# EAGLE design board_0.3v(fab) (EAGLE 7.7.0)
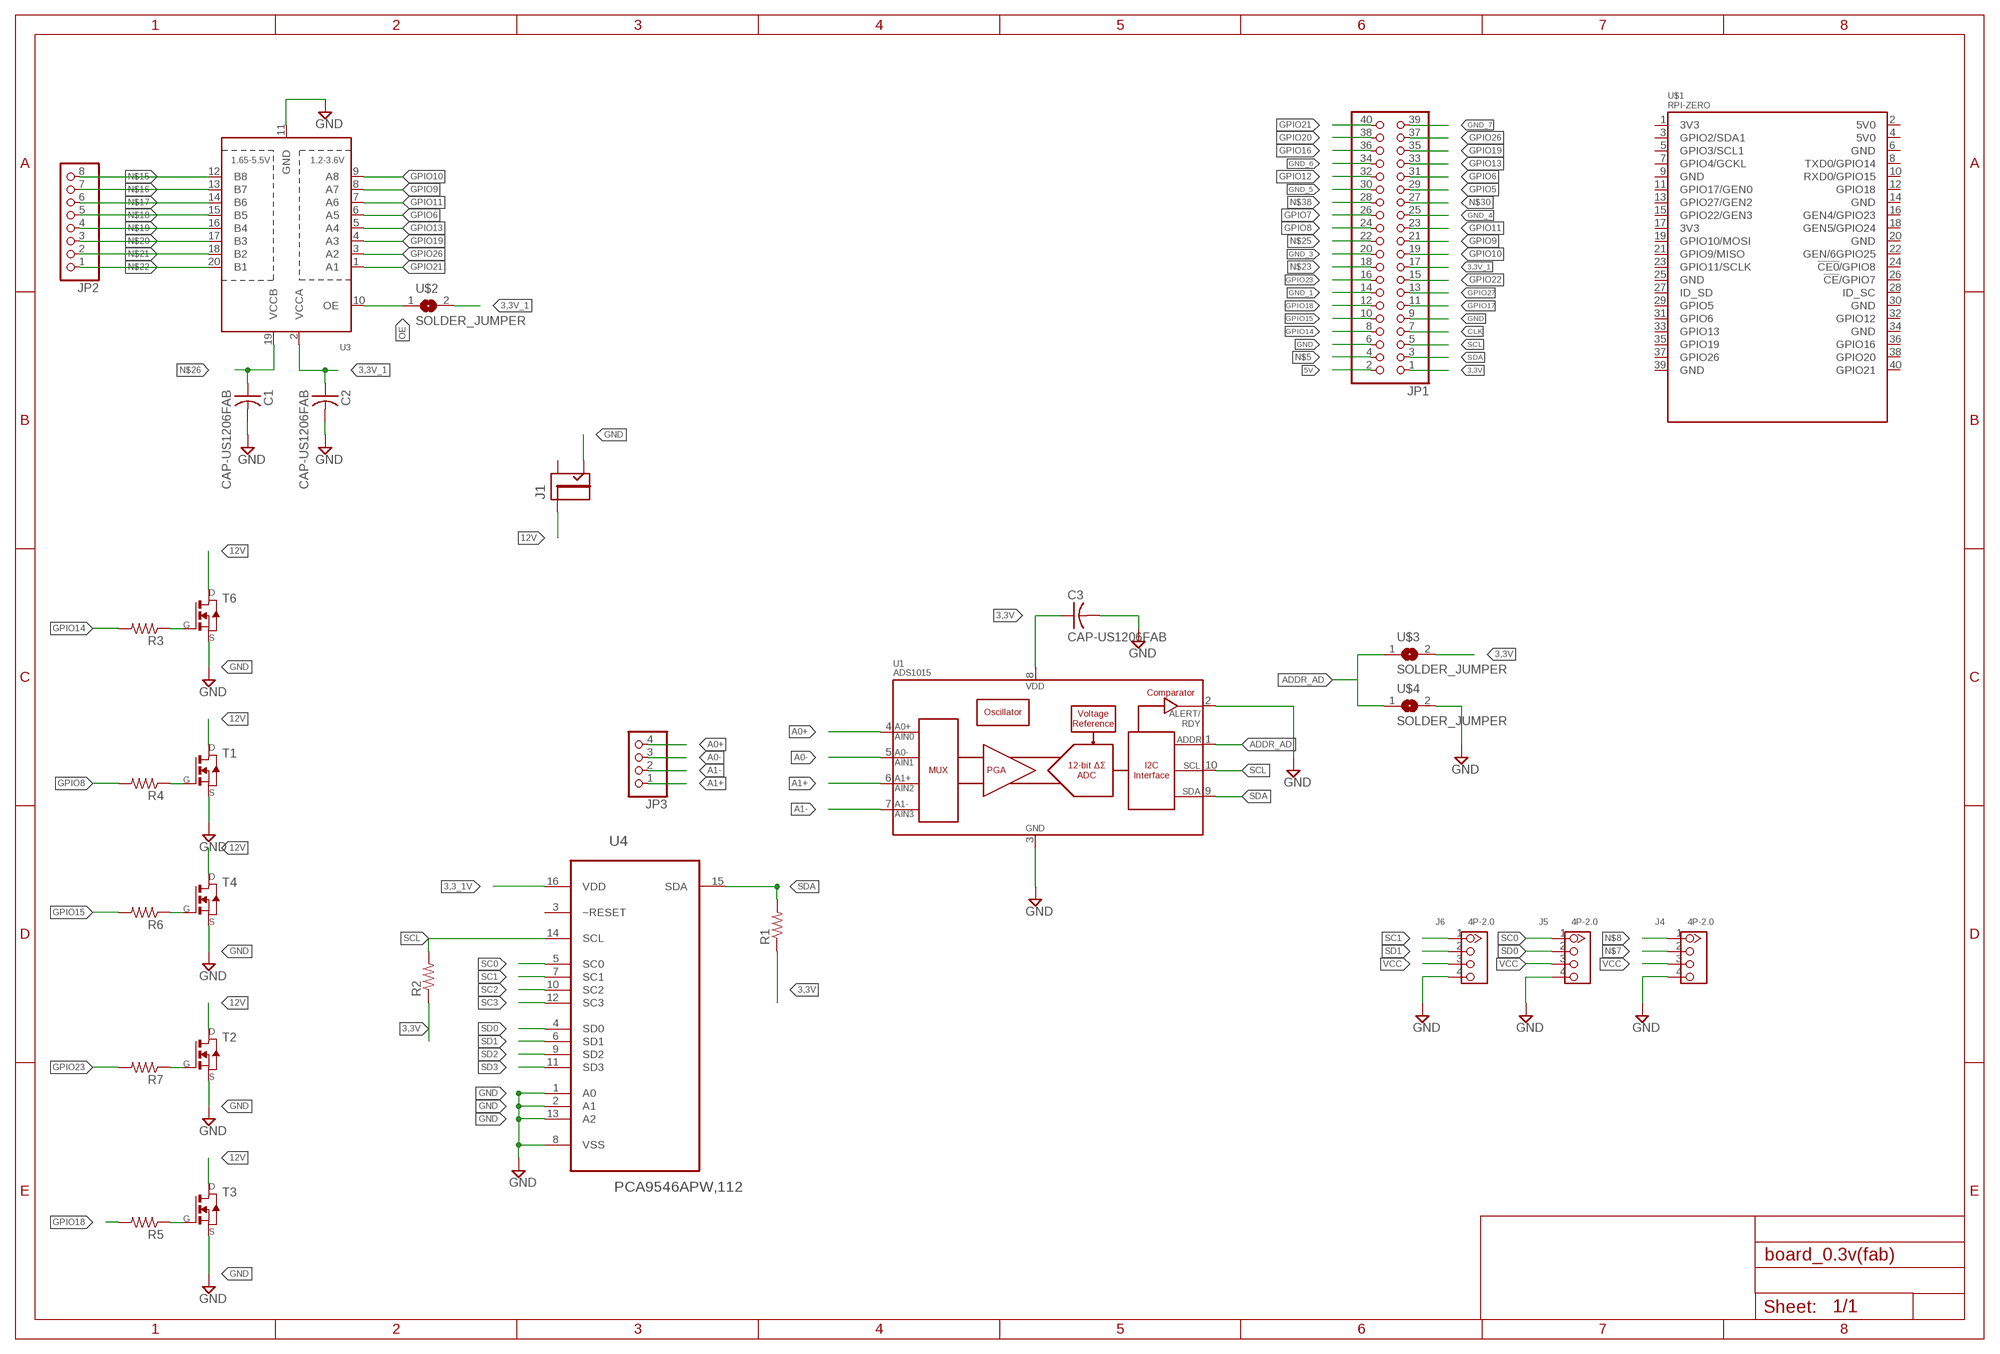
[diagram p0: schematic, sheet 1]

## Parts
C1  CAP-US1206FAB  [C1206FAB]
C2  CAP-US1206FAB  [C1206FAB]
C3  CAP-US1206FAB  [C1206FAB]
J1  JACK2.1MM  [JACK_2.1MM]
J4  4P-2.0  GROVE-CONNECTOR-DIP(4P-2.0)  [HW4-2.0]
J5  4P-2.0  GROVE-CONNECTOR-DIP(4P-2.0)  [HW4-2.0]
J6  4P-2.0  GROVE-CONNECTOR-DIP(4P-2.0)  [HW4-2.0]
JP1  PINHD-2X20  [2X20]
JP2  PINHD-1X8BIG  [1X08-BIG]
JP3  PINHD-1X4  [1X04]
R1  RES-US1206FAB  [R1206FAB]
R2  RES-US1206FAB  [R1206FAB]
R3  RES-US1206FAB  [R1206FAB]
R4  RES-US1206FAB  [R1206FAB]
R5  RES-US1206FAB  [R1206FAB]
R6  RES-US1206FAB  [R1206FAB]
R7  RES-US1206FAB  [R1206FAB]
T1  NMOSFETTO252  [TO252]
T2  NMOSFETTO252  [TO252]
T3  NMOSFETTO252  [TO252]
T4  NMOSFETTO252  [TO252]
T6  NMOSFETTO252  [TO252]
U1  ADS1015  [MSOP10]
U3  TXB0108PWR  [TSSOP20]
U4  PCA9546APW,112  [SOP65P640X110-16N]
U$1  RPI-ZERO  [RASPBERRYPI_BASTELSTUBE_V13_RASPI_BOARD_B+_FULL]
U$2  SOLDER_JUMPER  [SJFAB]
U$3  SOLDER_JUMPER  [SJFAB]
U$4  SOLDER_JUMPER  [SJFAB]

## Nets
3,3_1V: U4.16(VDD)
3,3V: C3.1 JP1.1 R1.1 R2.1 U1.8(VDD) U$3.2
3,3V_1: C2.1 JP1.17 U3.2(VCCA) U$2.2
5V: JP1.2
12V: J1.PIN T1.3(D) T2.3(D) T3.3(D) T4.3(D) T6.3(D)
A0+: JP3.4 U1.4(AIN0)
A0-: JP3.3 U1.5(AIN1)
A1+: JP3.1 U1.6(AIN2)
A1-: JP3.2 U1.7(AIN3)
ADDR_AD: U1.1(ADDR) U$3.1 U$4.1
CLK: JP1.7
GND: C1.2 C2.2 C3.2 J1.CONTACT J4.4 J5.4 J6.4 JP1.6 JP1.9 T1.2(S) T2.2(S) T3.2(S) T4.2(S) T6.2(S) U1.2(ALERT/RDY) U1.3(VSS) U3.11(GND) U4.1(A0) U4.2(A1) U4.8(VSS) U4.13(A2) U$4.2
GND_1: JP1.14
GND_3: JP1.20
GND_4: JP1.25
GND_5: JP1.30
GND_6: JP1.34
GND_7: JP1.39
GPIO5: JP1.29
GPIO6: JP1.31 U3.6(A5)
GPIO7: JP1.26
GPIO8: JP1.24 R4.2
GPIO9: JP1.21 U3.8(A7)
GPIO10: JP1.19 U3.9(A8)
GPIO11: JP1.23 U3.7(A6)
GPIO12: JP1.32
GPIO13: JP1.33 U3.5(A4)
GPIO14: JP1.8 R3.2
GPIO15: JP1.10 R6.2
GPIO16: JP1.36
GPIO17: JP1.11
GPIO18: JP1.12 R5.2
GPIO19: JP1.35 U3.4(A3)
GPIO20: JP1.38
GPIO21: JP1.40 U3.1(A1)
GPIO22: JP1.15
GPIO23: JP1.16 R7.2
GPIO26: JP1.37 U3.3(A2)
GPIO27: JP1.13
N$5: JP1.4
N$6: R3.1 T6.1(G)
N$7: J4.2
N$8: J4.1
N$9: R4.1 T1.1(G)
N$10: R6.1 T4.1(G)
N$11: R7.1 T2.1(G)
N$12: R5.1 T3.1(G)
N$15: JP2.8 U3.12(B8)
N$16: JP2.7 U3.13(B7)
N$17: JP2.6 U3.14(B6)
N$18: JP2.5 U3.15(B5)
N$19: JP2.4 U3.16(B4)
N$20: JP2.3 U3.17(B3)
N$21: JP2.2 U3.18(B2)
N$22: JP2.1 U3.20(B1)
N$23: JP1.18
N$25: JP1.22
N$26: C1.1 U3.19(VCCB)
N$30: JP1.27
N$38: JP1.28
OE: U3.10(OE) U$2.1
SC0: J5.1 U4.5(SC0)
SC1: J6.1 U4.7(SC1)
SC2: U4.10(SC2)
SC3: U4.12(SC3)
SCL: JP1.5 R2.2 U1.10(SCL) U4.14(SCL)
SD0: J5.2 U4.4(SD0)
SD1: J6.2 U4.6(SD1)
SD2: U4.9(SD2)
SD3: U4.11(SD3)
SDA: JP1.3 R1.2 U1.9(SDA) U4.15(SDA)
VCC: J4.3 J5.3 J6.3
Unconnected: J1.SHUNT U4.3(~RESET) U$1.1(3V3) U$1.2(5V0) U$1.3(GPIO2/SDA1) U$1.4(5V0) U$1.5(GPIO3/SCL1) U$1.6(GND) U$1.7(GPIO4/GCKL) U$1.8(TXD0/GPIO14) U$1.9(GND) U$1.10(RXD0/GPIO15) U$1.11(GPIO17/GEN0) U$1.12(GPIO18) U$1.13(GPIO27/GEN2) U$1.14(GND) U$1.15(GPIO22/GEN3) U$1.16(GEN4/GPIO23) U$1.17(3V3) U$1.18(GEN5/GPIO24) U$1.19(GPIO10/MOSI) U$1.20(GND) U$1.21(GPIO9/MISO) U$1.22(GEN/6GPIO25) U$1.23(GPIO11/SCLK) U$1.24(!CE0!/GPIO8) U$1.25(GND) U$1.26(!CE!/GPIO7) U$1.27(ID_SD) U$1.28(ID_SC) U$1.29(GPIO5) U$1.30(GND) U$1.31(GPIO6) U$1.32(GPIO12) U$1.33(GPIO13) U$1.34(GND) U$1.35(GPIO19) U$1.36(GPIO16) U$1.37(GPIO26) U$1.38(GPIO20) U$1.39(GND) U$1.40(GPIO21)

## Library data of the parts
C1-C3 = fab:CAP-US
J1 = fab:JACK
J4-J6 = Seeed-OPL-Connector:GROVE-CONNECTOR-DIP(4P-2.0): 320110033
JP1 = adafruit:PINHD-2X20: PIN HEADER
JP2 = adafruit:PINHD-1X8: PIN HEADER
JP3 = pinhead:PINHD-1X4: PIN HEADER
R1-R7 = fab:RES-US: Resistor (US Symbol) Variants with postfix FAB are widened to allow the routing of internal traces
T1-T4 T6 = fab_2:NMOSFET: MOS FET
U1 = SparkFun-IC-Conversion:ADS1015: ADS1015 12-BIT ADC 12-Bit Del-Sig ADC Four single-ended inputs or two differential inputs Internal PGA I2C interface 2.0-5.5V SparkFun Products SparkFun Block for Intel Edison - ADC <https://www.sparkfun.com/products/13770> (DEV-13770); PROD_ID: IC-12270
U3 = adafruit:TXB0108PWR: 8-Bit Bi-Directional Level Shifter 1.2V-3.6V (VCCA) to 1.65V-5.5V (VCCB) bi-directional level shifter with auto direction sensing. Max data rate - VCCA 1.8V: 20Mbps (50ns), VCCA 3.3V: 100Mbps (10ns) Digikey: 296-21527-1-ND
U4 = NXP_By_element14_Batch_1:PCA9546APW,112: 4-channel I2C-bus switch with reset; MPN: PCA9546APW,112; OC_FARNELL: 1831208; OC_NEWARK: 70R6610; PACKAGE: TSSOP-16; SUPPLIER: NXP
U$1 = RPI-Zero:RPI-ZERO
U$2-U$4 = fab:SOLDER_JUMPER

## Board
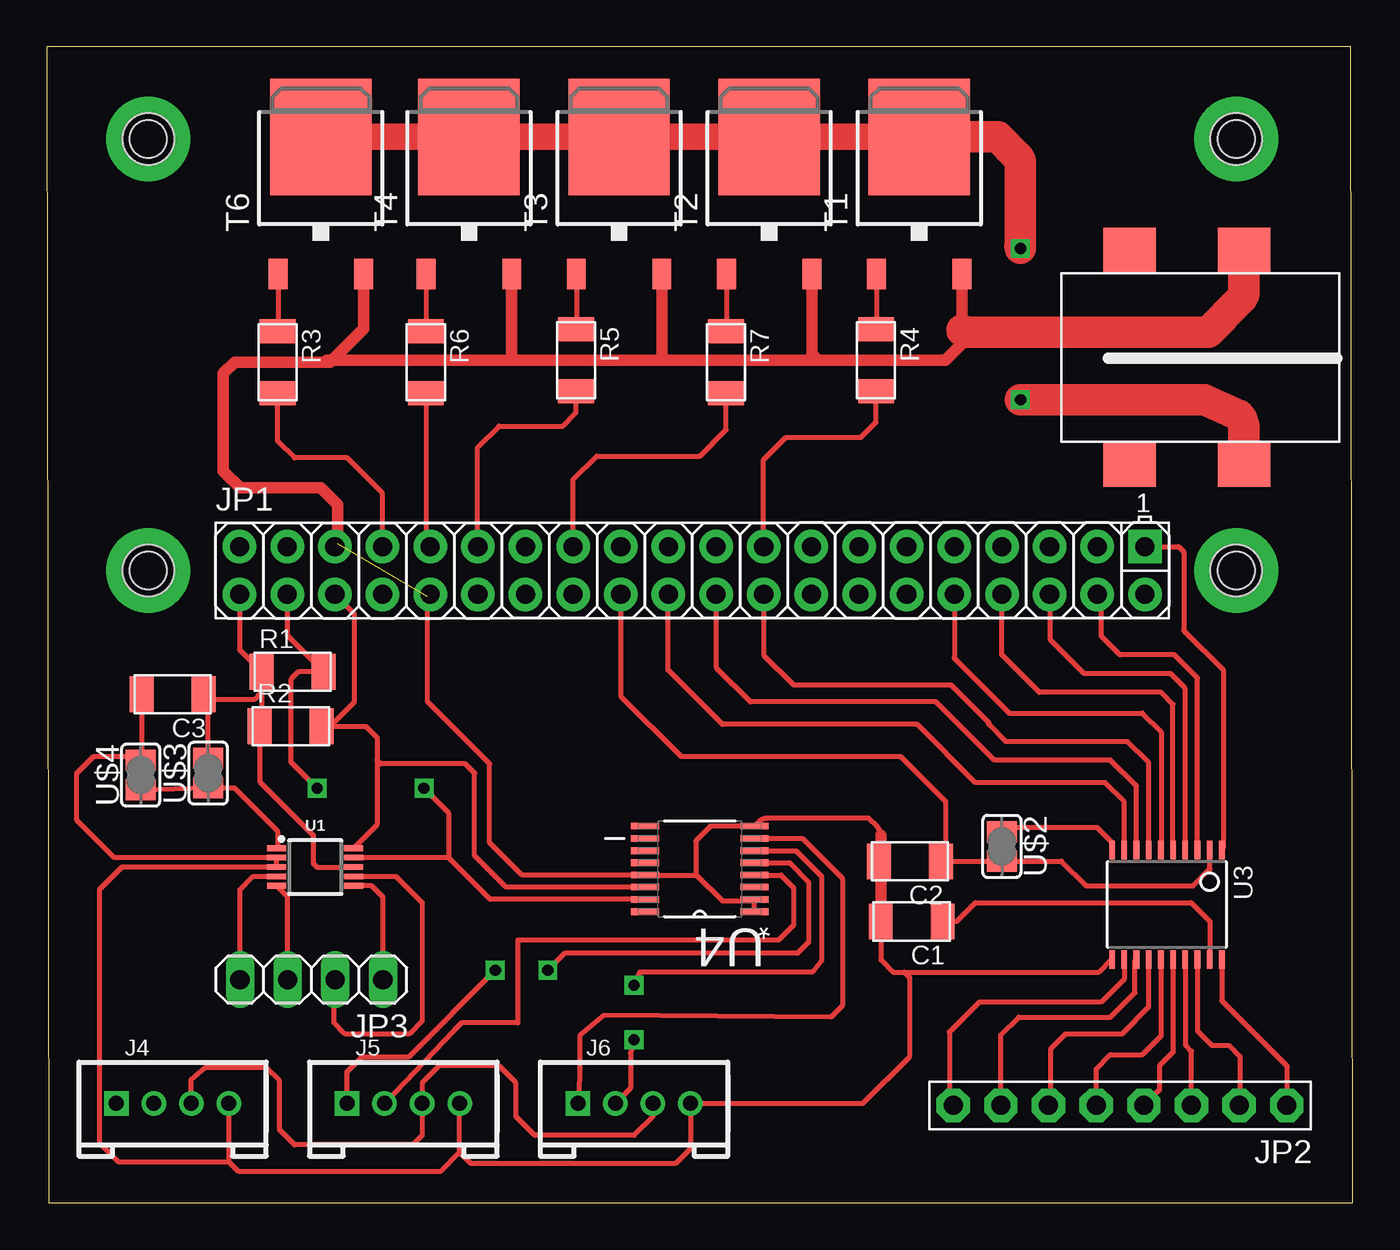
[diagram p1: board, top side]
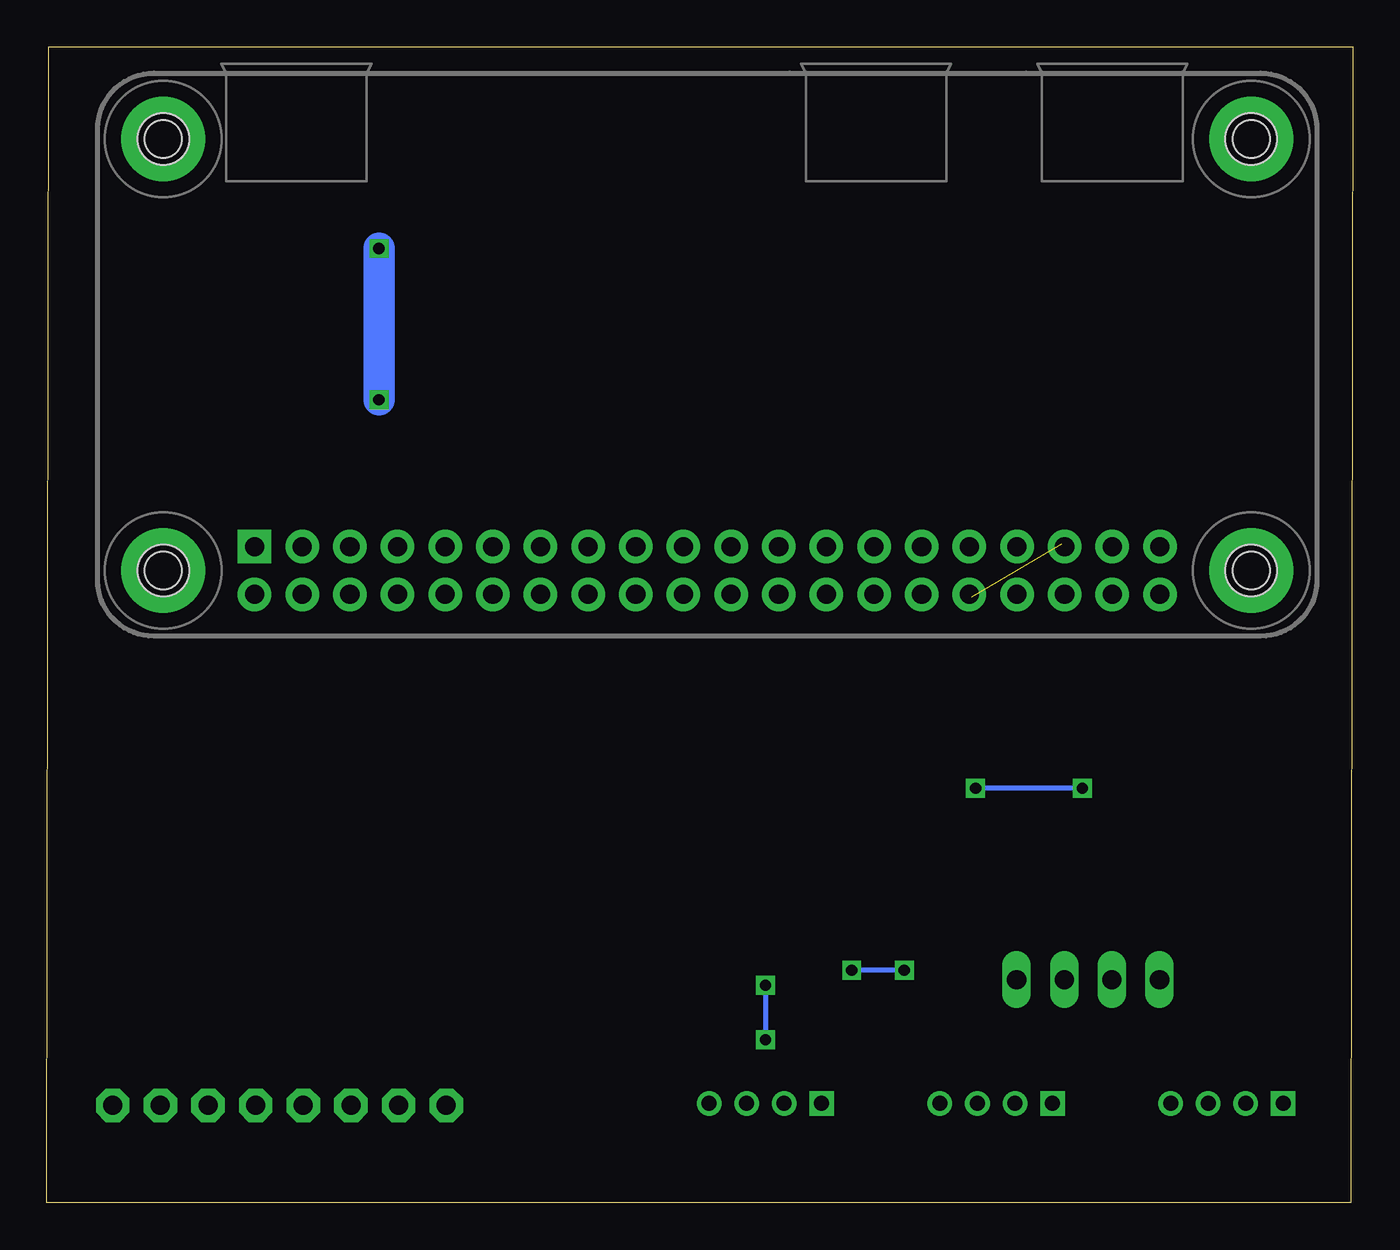
[diagram p2: board, bottom side, seen from below]

Size 69.6 x 61.6 mm. Coordinates in mm from the lower left corner, seen from the top.
Outline: 0.1,0 69.6,0 69.5,61.6 0,61.6 0.1,0
Copper layers (1*16): Top 0.035mm / dielectric 1.5mm / Bottom 0.035mm
Design rules "default": minimum track width 10mil, minimum drill 24mil, track to track 8mil, track to pad 8mil, pad to pad 8mil, via to via 8mil, smd to smd 8mil, copper to edge 40mil, drill to drill 8mil, minimum pad ring 10mil, minimum via ring 8mil, stop-mask expansion 4mil, vias tented up to drill 0mil, thermal gap 10mil
Holes 2 mm at 5.4,56.7 5.4,33.7 63.4,56.7 63.4,33.7

### Footprints (pad centres in the part's own frame; a part is rotated, then mirrored left to right if it is on the bottom)
C1206FAB = smd 1.27 x 1.905: 1 -1.651,0; 2 1.651,0
JACK_2.1MM = smd 2.388 x 2.794: CONTACT 5.766,-2.413; PIN -5.639,-2.413; PIN1 -5.639,3.683; SHUNT 5.766,3.683
HW4-2.0 = drill 0.8 pad 1.27 square: 1 -3,0 | drill 0.8 pad 1.27: 2 -1,0; 3 1,0; 4 3,0
2X20 = drill 1.016 octagon: 1 -24.13,-1.27; 2 -24.13,1.27; 3 -21.59,-1.27; 4 -21.59,1.27; 5 -19.05,-1.27; 6 -19.05,1.27; 7 -16.51,-1.27; 8 -16.51,1.27; 9 -13.97,-1.27; 10 -13.97,1.27; 11 -11.43,-1.27; 12 -11.43,1.27; 13 -8.89,-1.27; 14 -8.89,1.27; 15 -6.35,-1.27; 16 -6.35,1.27; 17 -3.81,-1.27; 18 -3.81,1.27; 19 -1.27,-1.27; 20 -1.27,1.27; 21 1.27,-1.27; 22 1.27,1.27; 23 3.81,-1.27; 24 3.81,1.27; 25 6.35,-1.27; 26 6.35,1.27; 27 8.89,-1.27; 28 8.89,1.27; 29 11.43,-1.27; 30 11.43,1.27; 31 13.97,-1.27; 32 13.97,1.27; 33 16.51,-1.27; 34 16.51,1.27; 35 19.05,-1.27; 36 19.05,1.27; 37 21.59,-1.27; 38 21.59,1.27; 39 24.13,-1.27; 40 24.13,1.27
1X08-BIG = drill 1.016 pad 1.778 octagon: 1 -8.89,0; 2 -6.35,0; 3 -3.81,0; 4 -1.27,0; 5 1.27,0; 6 3.81,0; 7 6.35,0; 8 8.89,0
1X04 = drill 1.016 long: 1 -3.81,0; 2 -1.27,0; 3 1.27,0; 4 3.81,0
R1206FAB = smd 1.27 x 1.905: 1 -1.651,0; 2 1.651,0
TO252 = smd 1 x 1.6: 1 -2.28,-4.8; 2 2.28,-4.8 | smd 5.4 x 6.2: 3 0,2.5
MSOP10 = smd 0.3 x 1: 1 -1,-2.05; 2 -0.5,-2.05; 3 0,-2.05; 4 0.5,-2.05; 5 1,-2.05; 6 1,2.05; 7 0.5,2.05; 8 0,2.05; 9 -0.5,2.05; 10 -1,2.05
TSSOP20 = smd 0.305 x 0.991: 1 -2.925,-2.918; 2 -2.275,-2.918; 3 -1.625,-2.918; 4 -0.975,-2.918; 5 -0.325,-2.918; 6 0.325,-2.918; 7 0.975,-2.918; 8 1.625,-2.918; 9 2.275,-2.918; 10 2.925,-2.918; 11 2.925,2.918; 12 2.275,2.918; 13 1.625,2.918; 14 0.975,2.918; 15 0.325,2.918; 16 -0.325,2.918; 17 -0.975,2.918; 18 -1.625,2.918; 19 -2.275,2.918; 20 -2.925,2.918
SOP65P640X110-16N = smd 1.473 x 0.356: 1 -2.921,2.286; 2 -2.921,1.626; 3 -2.921,0.965; 4 -2.921,0.33; 5 -2.921,-0.33; 6 -2.921,-0.965; 7 -2.921,-1.626; 8 -2.921,-2.286; 9 2.921,-2.286; 10 2.921,-1.626; 11 2.921,-0.965; 12 2.921,-0.33; 13 2.921,0.33; 14 2.921,0.965; 15 2.921,1.626; 16 2.921,2.286
RASPBERRYPI_BASTELSTUBE_V13_RASPI_BOARD_B+_FULL = drill 1 pad 1.778 square: 1 8.37,25.23 | drill 1 pad 1.778: 2 8.37,27.77; 3 10.91,25.23; 4 10.91,27.77; 5 13.45,25.23; 6 13.45,27.77; 7 15.99,25.23; 8 15.99,27.77; 9 18.53,25.23; 10 18.53,27.77; 11 21.07,25.23; 12 21.07,27.77; 13 23.61,25.23; 14 23.61,27.77; 15 26.15,25.23; 16 26.15,27.77; 17 28.69,25.23; 18 28.69,27.77; 19 31.23,25.23; 20 31.23,27.77; 21 33.77,25.23; 22 33.77,27.77; 23 36.31,25.23; 24 36.31,27.77; 25 38.85,25.23; 26 38.85,27.77; 27 41.39,25.23; 28 41.39,27.77; 29 43.93,25.23; 30 43.93,27.77; 31 46.47,25.23; 32 46.47,27.77; 33 49.01,25.23; 34 49.01,27.77; 35 51.55,25.23; 36 51.55,27.77; 37 54.09,25.23; 38 54.09,27.77; 39 56.63,25.23; 40 56.63,27.77 | hole 2.75: 3.5,3.5; 3.5,26.5; 61.5,3.5; 61.5,26.5
SJFAB = smd 1.118 x 1.6: 1 -0.787,0; 2 0.787,0

### Placement (x,y rotation side)
C1  46.1,15 180 top
C2  46,18.2 180 top
C3  6.7,27.1 180 top
J1  61.4,45 90 top
J4  6.7,5.3 0 top
J5  19,5.3 0 top
J6  31.3,5.3 0 top
JP1  34.4,33.7 0 top
JP2  57.2,5.2 180 top
JP3  14.1,11.9 180 top
R1  13.1,28.3 0 top
R2  13,25.4 0 top
R3  12.3,44.8 270 top
R4  44.2,44.9 270 top
R5  28.2,44.9 270 top
R6  20.2,44.8 270 top
R7  36.2,44.8 270 top
T1  46.5,54.3 0 top
T2  38.5,54.3 0 top
T3  30.5,54.3 0 top
T4  22.5,54.3 0 top
T6  14.6,54.3 0 top
U1  14.3,17.9 270 top
U3  59.7,15.9 180 top
U4  34.8,17.8 180 top
U$1  66.9,60.2 180 top
U$2  50.9,19 270 top
U$3  8.6,22.9 90 top
U$4  5,22.8 90 top

### Tracks (layer width: path | path; a pad name or v marks a point on that pad's centre or on a via)
3,3V
  Top 0.254: U$3.2 8.6,26.85 | 8.6,26.85 C3.1 | JP1.1 10.27,29.48 R1.1 11.45,27.2 | 11.45,27.2 11.45,25.5 R2.1 11.35,22.45 14.2,19.6 14.2,18.1 14.4,17.9 U1.8 | 8.6,26.85 11.1,26.85 11.45,27.2
3,3V_1
  Top 0.254: C2.1 48.2,18.2 | 48.2,18.2 50.89,18.2 U$2.2 54.09,18.21 55.4,16.9 61.1,16.9 62,17.8 62,18.79 U3.2 | JP1.17 30.59,27.01 33.8,23.8 45.5,23.8 47.9,21.4 47.9,18.5 48.2,18.2
12V  (via drill 0.6)
  Top 1.422: T1.3 46,56.8 T2.3 T3.3 T4.3 T6.3
  Top 1.676: J1.PIN 63.81,41.22 arc45 63.53,41.97 61.7,42.8 v51.9,42.8 | v51.9,50.86 arc-45 51.9,51.1 51.9,55.34 arc45 51.71,55.79 50.7,56.8 46,56.8
  Bottom 1.676: v51.9,42.8 v51.9,50.86
A0+
  Top 0.254: JP3.4 10.29,16.69 11,17.4 U1.4
A0-
  Top 0.254: JP3.3 12.83,16.32 U1.5
A1+
  Top 0.254: JP3.1 17.91,16.29 17.3,16.9 U1.6
A1-
  Top 0.254: U1.7 18.6,17.4 20,16 20,9.7 19.3,9 15.9,9 15.3,9.6 15.3,11.83 JP3.2
ADDR_AD
  Top 0.254: U$4.1 U$3.1 9.99,22.11 12.3,19.8 12.3,18.95 U1.1
GND  (1 unrouted)
  Top 0.254: U4.1 U4.2 37.65,16.1 36,16.1 34.63,17.47 | 45.7,12.3 45.1,12.3 44.45,12.95 C1.2 44.45,18.1 C2.2 | 45.7,12.3 56.09,12.3 U3.11 | 45.7,12.3 46,12 46,7.8 43.5,5.3 J6.4 34.3,2.9 33.5,2.1 22.6,2.1 22,2.7 | 22,2.7 J5.4 | J4.4 9.7,2.2 | 9.7,2.2 10.2,1.7 21,1.7 22,2.7 | C3.2 5.05,23.64 U$4.2 4.79,23.8 2.5,23.8 1.6,22.9 1.6,20.4 3.6,18.4 U1.2 U1.3 4,17.9 2.8,16.7 2.8,3.2 3.8,2.2 9.7,2.2 | JP1.9 20.3,32.3 20.3,26.7 23.6,23.4 23.6,19.2 25.33,17.47 U4.13 34.63,17.47 | 34.63,17.47 34.6,17.5 34.6,19.3 35.39,20.09 U4.8 37.95,20.31 arc-45 38.4,20.5 43.8,20.5 44.26,20.04 arc-45 44.45,19.59
  Top 0.61: T6.2 16.88,46.58 15.1,44.8 14.8,44.8 | 14.8,44.8 10,44.8 9.4,44.2 9.4,39 10.3,38.1 14.6,38.1 15.5,37.2 15.5,35.12 JP1.6 | T1.2 48.78,46.5 48.78,45.78 47.9,44.9 41.1,44.9 | 41.1,44.9 33,44.9 | 33,44.9 24.9,44.9 | 24.9,44.9 14.9,44.9 14.8,44.8 | T4.2 24.78,45.02 24.9,44.9 | T3.2 32.78,45.12 33,44.9 | T2.2 40.78,45.22 41.1,44.9 | C1.2 44.45,19.59
  Top 1.676: J1.CONTACT 63.81,48.58 arc-45 63.63,48.13 61.9,46.4 49.02,46.4 arc-45 48.78,46.5
GPIO6
  Top 0.254: JP1.31 48.37,29.03 51.3,26.1 58.4,26.1 59.4,25.1 59.4,18.84 U3.6
GPIO8
  Top 0.254: JP1.24 38.21,39.61 39.4,40.8 43.4,40.8 44.2,41.6 R4.2
GPIO9
  Top 0.254: U3.8 58.08,22.22 56.7,23.6 50.5,23.6 47.4,26.7 37.5,26.7 35.7,28.5 35.7,32.4 JP1.21
GPIO10
  Top 0.254: U3.9 57.42,21.38 56.4,22.4 49.5,22.4 46.4,25.5 36,25.5 33.1,28.4 33.1,32.4 JP1.19
GPIO11
  Top 0.254: JP1.23 38.21,29.19 39.8,27.6 48.2,27.6 50.2,25.6 50.2,25.5 51.1,24.6 57.6,24.6 58.7,23.5 58.7,18.84 U3.7
GPIO13
  Top 0.254: U3.5 60.02,26.57 59.4,27.2 52.9,27.2 50.9,29.2 JP1.33
GPIO14
  Top 0.254: JP1.8 17.89,37.81 16,39.7 13.2,39.7 12.3,40.6 R3.2
GPIO15
  Top 0.254: R6.2 20.2,35.2 JP1.10
GPIO18
  Top 0.254: JP1.12 22.97,40.27 24.1,41.4 27.5,41.4 28.2,42.1 R5.2
GPIO19
  Top 0.254: U3.4 60.67,27.42 59.9,28.2 55.3,28.2 53.5,30 53.5,32.38 JP1.35
GPIO21
  Top 0.254: JP1.40 60.33,34.97 60.6,34.7 60.6,30.5 62.7,28.4 62.7,18.89 U3.1
GPIO23
  Top 0.254: JP1.16 28.05,38.55 29.3,39.8 34.8,39.8 36.2,41.2 R7.2
GPIO26
  Top 0.254: U3.3 61.33,27.97 60.1,29.2 57.2,29.2 56.2,30.2 56.2,32.22 JP1.37
N$1  (via drill 2.8 pad 4.5)
  other vias: 63.4,56.7
N$2  (via drill 2.8 pad 4.5)
  other vias: 5.4,56.7
N$3  (via drill 2.8 pad 4.5)
  other vias: 5.4,33.7
N$4  (via drill 2.8 pad 4.5)
  other vias: 63.4,33.7
N$6
  Top 0.254: T6.1 12.32,46.47 R3.1
N$9
  Top 0.254: T1.1 44.22,46.57 R4.1
N$10
  Top 0.254: T4.1 20.22,46.47 R6.1
N$11
  Top 0.254: T2.1 36.22,46.47 R7.1
N$12
  Top 0.254: T3.1 28.22,46.57 R5.1
N$15
  Top 0.254: U3.12 57.42,11.93 56.2,10.7 49.7,10.7 48.1,9.1 48.1,5.41 JP2.8
N$16
  Top 0.254: JP2.7 50.85,8.95 51.8,9.9 56.7,9.9 58,11.2 58,12.91 U3.13
N$17
  Top 0.254: U3.14 58.73,10.43 57.3,9 54.3,9 53.5,8.2 53.5,5.31 JP2.6
N$18
  Top 0.254: JP2.5 55.93,7.13 56.7,7.9 58.4,7.9 59.4,8.9 59.4,12.96 U3.15
N$19
  Top 0.254: U3.16 60.02,8.03 59.3,7.3 59.3,6.03 JP2.4
N$20
  Top 0.254: JP2.3 61.01,8.09 60.7,8.4 60.7,12.96 U3.17
N$21
  Top 0.254: U3.18 61.33,9.18 62.1,8.4 63,8.4 63.6,7.8 63.6,5.25 JP2.2
N$22
  Top 0.254: U3.20 62.62,10.78 66.1,7.3 JP2.1
N$26
  Top 0.254: C1.1 48.5,15 49.5,16 61,16 62,15 62,13.01 U3.19
OE
  Top 0.254: U3.10 56.77,19.22 56,20 51.11,20 U$2.1
SC0  (via drill 0.6)
  Top 0.254: U4.5 39.57,18.13 40.6,17.1 40.6,13.9 40,13.3 27.6,13.3 v26.7,12.4 | J5.1 16,7 16.8,7.8 19.3,7.8 v23.9,12.4
  Bottom 0.254: v23.9,12.4 v26.7,12.4
SC1
  Top 0.254: U4.7 40.27,19.43 42.4,17.3 42.4,10.5 41.8,9.9 29.7,10 28.4,8.9 28.4,6.7 J6.1
SCL
  Top 0.254: R2.2 15.1,25.4 | 15.1,25.4 16.4,26.7 16.4,31.38 JP1.5 | 15.1,25.4 17,25.4 17.6,24.8 17.6,23.6 | 17.6,23.6 17.6,20.15 U1.10 | U4.14 24.46,16.83 22.8,18.5 22.8,22.9 22.3,23.4 17.8,23.4 17.6,23.6
SD0
  Top 0.254: U4.4 39.13,17.47 39.8,16.8 39.8,14.8 39,14 25.1,14 25.1,9.6 22.1,9.6 21.7,9.2 J5.2
SD1  (via drill 0.6)
  Top 0.254: U4.6 39.94,18.76 41.3,17.4 41.3,12.9 40.8,12.3 31.6,12.3 v31.3,11.6 | v31.3,8.7 31.1,8 31.1,6.1 J6.2
  Bottom 0.254: v31.3,11.6 v31.3,8.7
SDA  (via drill 0.6)
  Top 0.254: JP1.3 12.81,30.24 R1.2 13.4,28.3 13,27.9 13,23.5 v14.4,22.1 | v20.1,22.1 21.4,20.8 21.4,18.4 | 21.4,18.4 U1.9 | U4.15 23.63,16.17 21.4,18.4
  Bottom 0.254: v14.4,22.1 v20.1,22.1
VCC
  Top 0.254: J4.3 7.7,6.6 8.4,7.2 11.7,7.2 12.4,6.5 12.4,3.9 13.2,3.1 19.5,3.1 20,3.6 J5.3 20,6.4 20.9,7.3 24.1,7.3 25,6.4 25,4.6 26,3.6 31.3,3.6 32.3,4.6 J6.3